# EAGLE schematic schemat_polaczen (EAGLE 9.6.2)
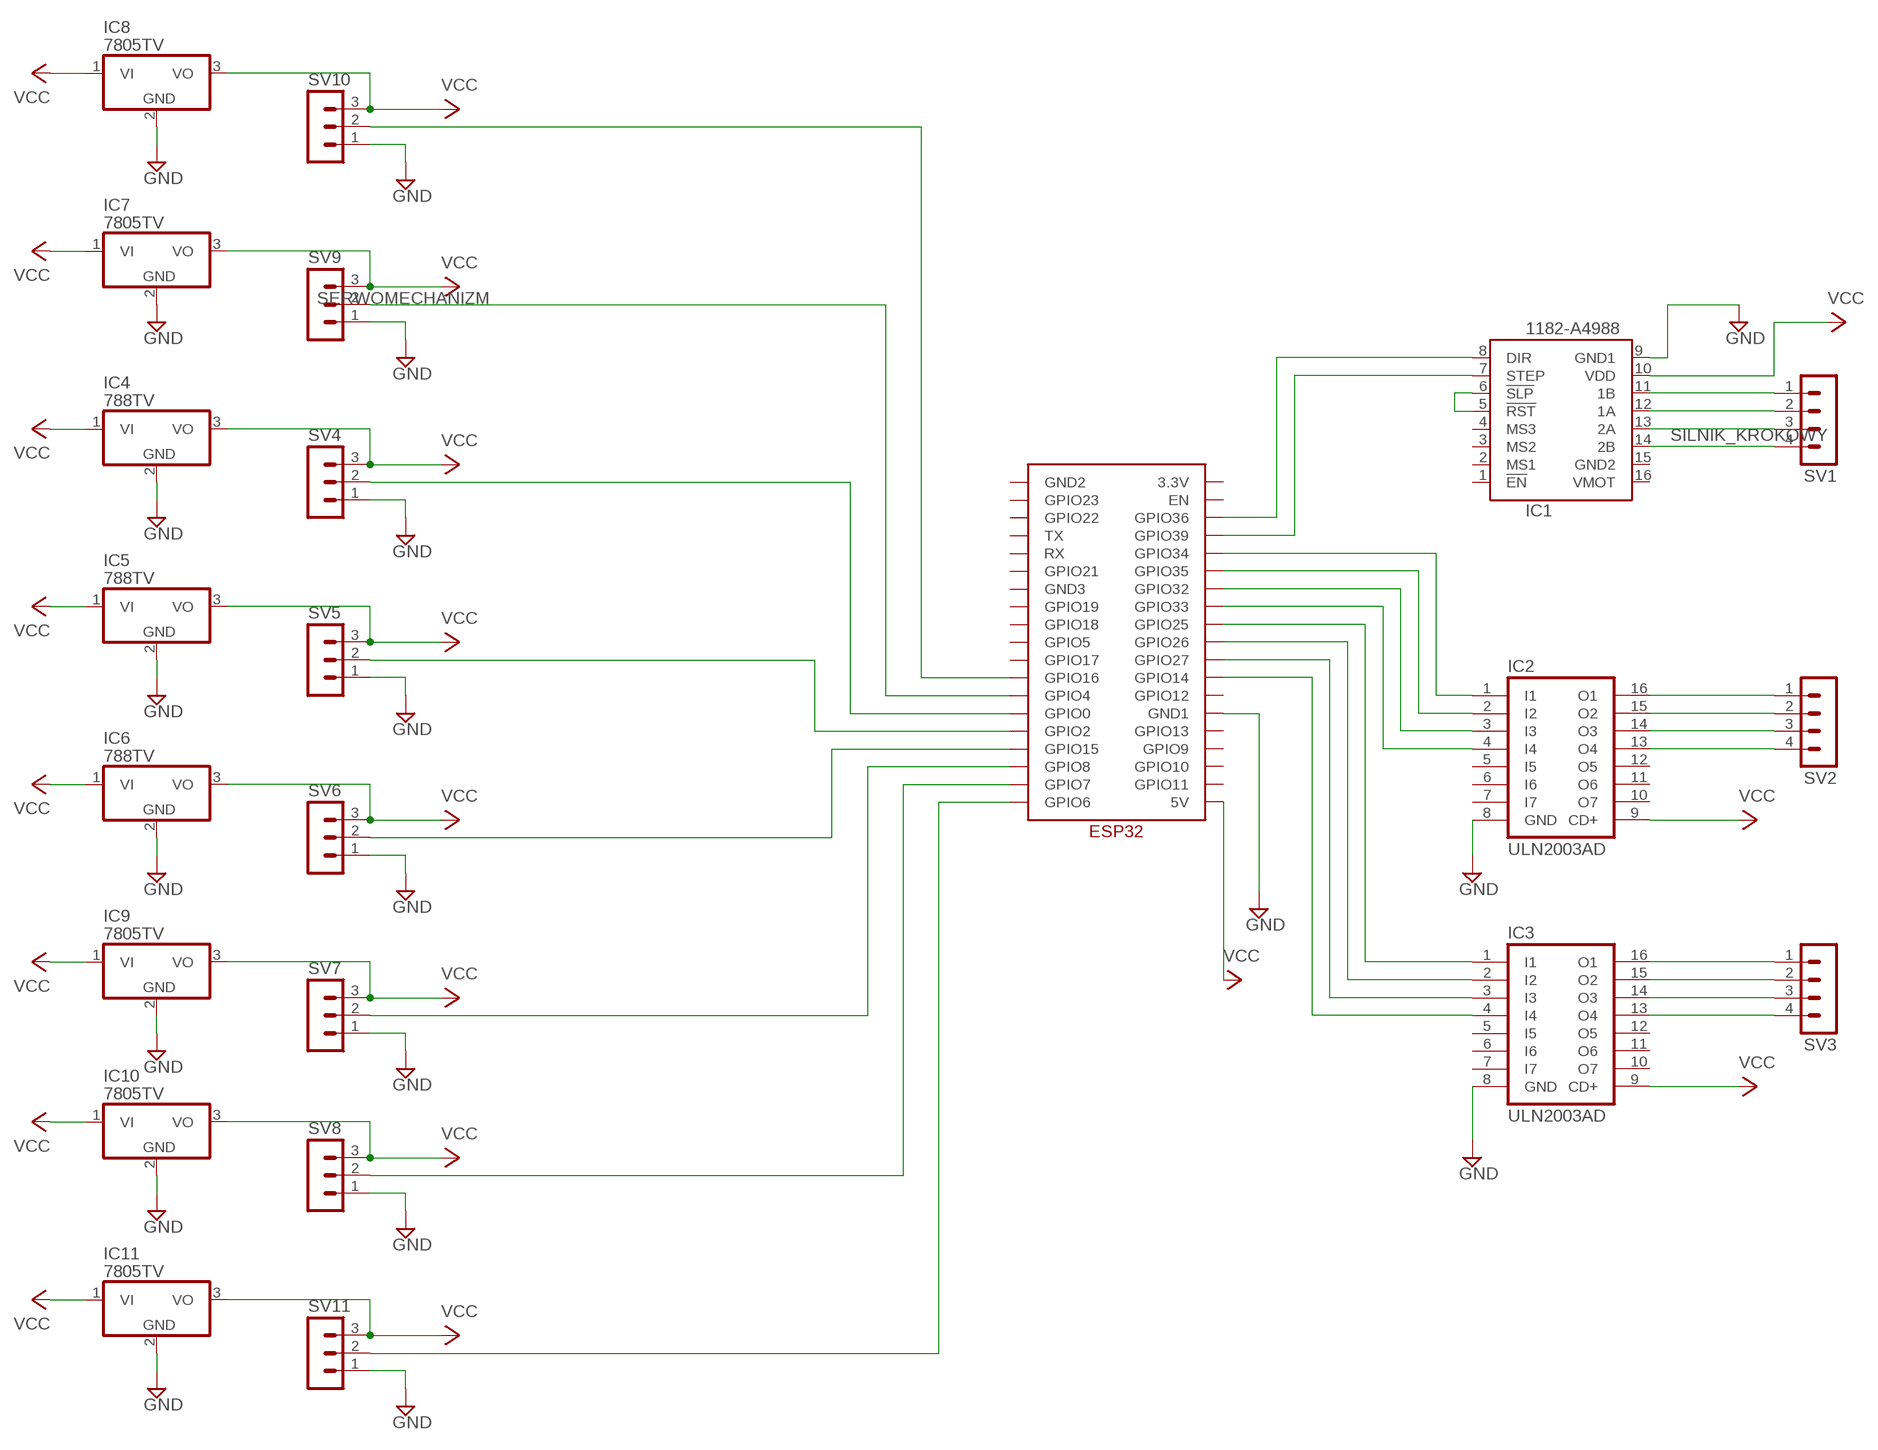
[diagram p0: schematic, sheet 1]

## Parts
IC1  1182-A4988  [A4988]
IC2  ULN2003AD  [SO16]
IC3  ULN2003AD  [SO16]
IC4  788TV  [TO220V]
IC5  788TV  [TO220V]
IC6  788TV  [TO220V]
IC7  7805TV  [TO220V]
IC8  7805TV  [TO220V]
IC9  7805TV  [TO220V]
IC10  7805TV  [TO220V]
IC11  7805TV  [TO220V]
SV1  MA04-1  [MA04-1]
SV2  MA04-1  [MA04-1]
SV3  MA04-1  [MA04-1]
SV4  MA03-1  [MA03-1]
SV5  MA03-1  [MA03-1]
SV6  MA03-1  [MA03-1]
SV7  MA03-1  [MA03-1]
SV8  MA03-1  [MA03-1]
SV9  MA03-1  [MA03-1]
SV10  MA03-1  [MA03-1]
SV11  MA03-1  [MA03-1]
U$1  ESP32  [ESP32]

## Nets
GND: IC1.9(GND1) IC2.8(GND) IC3.8(GND) IC4.2(GND) IC5.2(GND) IC6.2(GND) IC7.2(GND) IC8.2(GND) IC9.2(GND) IC10.2(GND) SV4.1 SV5.1 SV6.1 SV7.1 SV8.1 SV9.1 SV10.1 SV11.1 U$1.GND1
N$1: IC3.16(O1) SV3.1
N$2: IC3.15(O2) SV3.2
N$3: IC3.14(O3) SV3.3
N$4: IC3.13(O4) SV3.4
N$5: IC2.16(O1) SV2.1
N$6: IC2.15(O2) SV2.2
N$7: IC2.14(O3) SV2.3
N$8: IC2.13(O4) SV2.4
N$9: IC1.11(1B) SV1.1
N$10: IC1.12(1A) SV1.2
N$11: IC1.13(2A) SV1.3
N$12: IC1.14(2B) SV1.4
N$13: IC1.5(!RST) IC1.6(!SLP)
N$14: IC1.7(STEP) U$1.GPIO39
N$15: IC1.8(DIR) U$1.GPIO36
N$16: IC2.1(I1) U$1.GPIO34
N$17: IC2.2(I2) U$1.GPIO35
N$18: IC2.3(I3) U$1.GPIO32
N$19: IC2.4(I4) U$1.GPIO33
N$20: IC3.1(I1) U$1.GPIO25
N$21: IC3.2(I2) U$1.GPIO26
N$22: IC3.3(I3) U$1.GPIO27
N$23: IC3.4(I4) U$1.GPIO14
N$24: SV11.2 U$1.GPIO6
N$25: SV8.2 U$1.GPIO7
N$26: SV7.2 U$1.GPIO8
N$27: SV6.2 U$1.GPIO15
N$28: SV5.2 U$1.GPIO2
N$29: SV4.2 U$1.GPIO0
N$30: SV9.2 U$1.GPIO4
N$31: SV10.2 U$1.GPIO16
VCC: IC1.10(VDD) IC2.9(CD+) IC3.9(CD+) IC4.1(VI) IC4.3(VO) IC5.1(VI) IC5.3(VO) IC6.1(VI) IC6.3(VO) IC7.1(VI) IC7.3(VO) IC8.1(VI) IC8.3(VO) IC9.1(VI) IC9.3(VO) IC10.1(VI) IC10.3(VO) IC11.1(VI) IC11.2(GND) IC11.3(VO) SV4.3 SV5.3 SV6.3 SV7.3 SV8.3 SV9.3 SV10.3 SV11.3 U$1.5V ; supply symbol labelled GND
Unconnected: IC1.1(!EN) IC1.2(MS1) IC1.3(MS2) IC1.4(MS3) IC2.5(I5) IC2.6(I6) IC2.7(I7) IC2.10(O7) IC2.11(O6) IC2.12(O5) IC3.5(I5) IC3.6(I6) IC3.7(I7) IC3.10(O7) IC3.11(O6) IC3.12(O5) U$1.3.3V U$1.EN U$1.GND2 U$1.GND3 U$1.GPIO5 U$1.GPIO9 U$1.GPIO10 U$1.GPIO11 U$1.GPIO12 U$1.GPIO13 U$1.GPIO17 U$1.GPIO18 U$1.GPIO19 U$1.GPIO21 U$1.GPIO22 U$1.GPIO23 U$1.RX U$1.TX

## Power pins joined to a net without a drawn wire
GND2: IC1.15(GND2)
VMOT: IC1.16(VMOT)

## Library data of the parts
IC1 = pololu-stepper-driver:1182-A4988: A4988 Stepper Motor Driver Carrier #1182 A4988 Stepper Motor Driver Carrier <https://www.pololu.com/product/1182> in Japan, Suzaku Lab. Ltd. <https://suzakugiken.jp/> #1182 A4988ステッピングモータドライバ <https://szc.jp/po1182>
IC2 IC3 = uln-udn:ULN2003A: DRIVER ARRAY
IC4-IC11 = linear:78*: Positive VOLTAGE REGULATOR Source: http://cache.national.com/ds/LM/LM78L05.pdf http://www.fairchildsemi.com/ds/LM/LM7805.pdf
SV1-SV3 = con-lstb:MA04-1: PIN HEADER; OC_FARNELL: unknown; OC_NEWARK: unknown
SV4-SV11 = con-lstb:MA03-1: PIN HEADER; OC_FARNELL: unknown; OC_NEWARK: unknown
U$1 = ESP32:ESP32